# EAGLE design master (EAGLE 7.4.0)

## Sheet 1 of 2
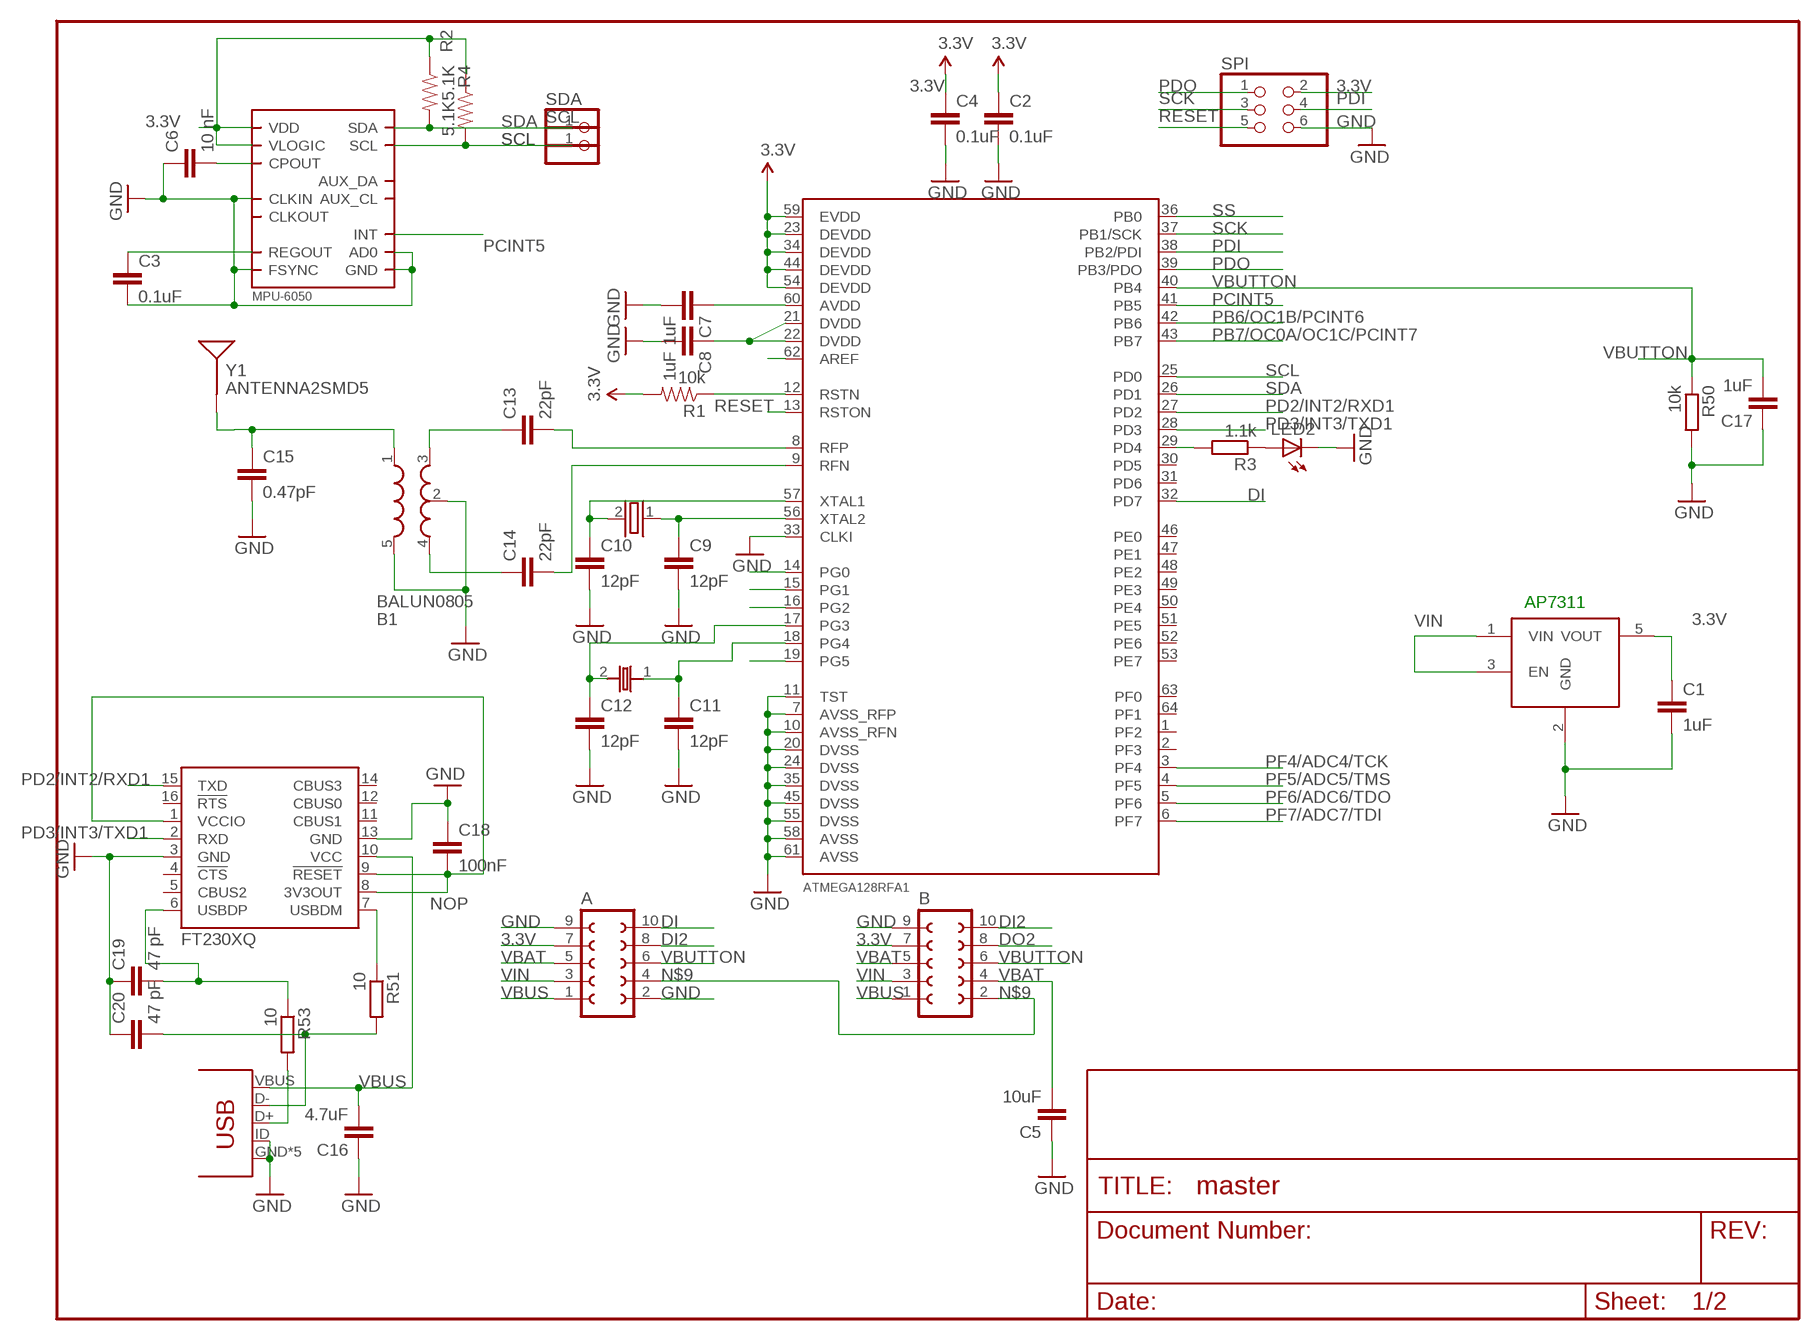
[diagram p0: schematic, sheet 1]

### Parts
A  FE05-2W  [FE05-2W]
B  FE05-2W  [FE05-2W]
B1  BALUN0805  [BALUN]
C1  1uF  C-EUC0603  [C0603]
C2  0.1uF  CAP0603-CAP  [0603-CAP]
C3  0.1uF  CAP0603-CAP  [0603-CAP]
C4  0.1uF  CAP0603-CAP  [0603-CAP]
C5  10uF  CAP0603-CAP  [0603-CAP]
C6  10 nF  CAP0603-CAP  [0603-CAP]
C7  1uF  CAP0805  [0805]
C8  1uF  CAP0805  [0805]
C9  12pF  CAP0603-CAP  [0603-CAP]
C10  12pF  CAP0603-CAP  [0603-CAP]
C11  12pF  CAP0603-CAP  [0603-CAP]
C12  12pF  CAP0603-CAP  [0603-CAP]
C13  22pF  CAP0603-CAP  [0603-CAP]
C14  22pF  CAP0603-CAP  [0603-CAP]
C15  0.47pF  CAP0603-CAP  [0603-CAP]
C16  4.7uF  CAP0603-CAP  [0603-CAP]
C17  1uF  CAP0805  [0805]
C18  100nF  CAP0603-CAP  [0603-CAP]
C19  47 pF  CAP0603-CAP  [0603-CAP]
C20  47 pF  CAP0603-CAP  [0603-CAP]
IC1  FT230XQ  [QFN16]
LED2  LEDCHIPLED_0603  [CHIPLED_0603]
MICRO-USB  USB-CONNECTOR  [MICRO-USB-435-645]
QUARTZ1  753-7203  [753-7203]
QUARTZ2  QUARTZ32768  [QUARTZ32768]
R1  10k  RESISTOR0603-RES  [0603-RES]
R2  5.1K  RESISTOR0603-RES  [0603-RES]
R3  1.1k  R-EU_R0603  [R0603]
R4  5.1K  RESISTOR0603-RES  [0603-RES]
R50  10k  R-EU_R0603  [R0603]
R51  10  R-EU_R0603  [R0603]
R53  10  R-EU_R0603  [R0603]
SCL  PINHD-1X1  [1X01]
SDA  PINHD-1X1  [1X01]
SPI  PINHD-2X3  [2X03]
U1  ATMEGA128RFA1  [QFN-64]
U$1  MPU-6050  [QFN.24.4X4]
U$7  MIC5366-2.8YMT  [SOT23-5]
Y1  ANTENNA2SMD5  [ANTENNA-CHIP5]

### Nets
3.3V: A.7 B.7 C1.1 C2.1 C4.1 R1.2 R2.1 R4.1 SPI.2 U1.23(DEVDD) U1.34(DEVDD) U1.44(DEVDD) U1.54(DEVDD) U1.59(EVDD) U$1.8(VLOGIC) U$1.13(VDD) U$7.5(VOUT)
AREF: U1.62(AREF)
DI: A.10 U1.32(PD7)
DI2: A.8 B.10
DO2: B.8
GND: A.2 A.9 B1.2(GND) B1.5(GND) B.9 C1.2 C2.2 C3.2 C4.2 C5.1 C6.1 C7.2 C8.2 C9.2 C10.2 C11.2 C12.2 C15.2 C16.1 C17.1 C18.1 C19.1 C20.1 IC1.3(GND) IC1.13(GND) LED2.C MICRO-USB.GND MICRO-USB.GND1(GND) MICRO-USB.GND2(GND) MICRO-USB.GND3(GND) MICRO-USB.GND4(GND) MICRO-USB.ID R50.2 SPI.6 U1.7(AVSS_RFP) U1.10(AVSS_RFN) U1.11(TST) U1.20(DVSS) U1.24(DVSS) U1.33(CLKI) U1.35(DVSS) U1.45(DVSS) U1.55(DVSS) U1.58(AVSS) U1.61(AVSS) U$1.1(CLKIN) U$1.9(AD0) U$1.11(FSYNC) U$1.18(GND) U$7.2(GND)
N$1: B1.3(OUT1) C13.1
N$2: B1.4(OUT2) C14.1
N$3: LED2.A R3.1
N$4: B1.1(IN) C15.1 Y1.FEED(SIGNAL)
N$5: C8.1 U1.21(DVDD) U1.22(DVDD)
N$6: C14.2 U1.9(RFN)
N$7: C13.2 U1.8(RFP)
N$8: R3.2 U1.29(PD4)
N$9: A.4 B.2
N$10: C7.1 U1.60(AVDD)
N$11: C3.1 U$1.10(REGOUT)
N$12: C10.1 QUARTZ1.2 U1.57(XTAL1)
N$13: C9.1 QUARTZ1.1 U1.56(XTAL2)
N$14: C12.1 QUARTZ2.2 U1.17(PG3)
N$15: C11.1 QUARTZ2.1 U1.18(PG4)
N$16: C6.2 U$1.20(CPOUT)
N$64: IC1.7(USBDM) R51.1
N$65: C20.2 MICRO-USB.D- R51.2
N$109: C19.2 IC1.6(USBDP) R53.1
N$110: MICRO-USB.D+ R53.2
NOP: C18.2 IC1.1(VCCIO) IC1.8(3V3OUT) IC1.9(!RESET)
PB6/OC1B/PCINT6: U1.42(PB6)
PB7/OC0A/OC1C/PCINT7: U1.43(PB7)
PCINT5: U1.41(PB5) U$1.12(INT)
PD2/INT2/RXD1: IC1.15(TXD) U1.27(PD2)
PD3/INT3/TXD1: IC1.2(RXD) U1.28(PD3)
PDI: SPI.4 U1.38(PB2/PDI)
PDO: SPI.1 U1.39(PB3/PDO)
PF4/ADC4/TCK: U1.3(PF4)
PF5/ADC5/TMS: U1.4(PF5)
PF6/ADC6/TDO: U1.5(PF6)
PF7/ADC7/TDI: U1.6(PF7)
PG0: U1.14(PG0)
PG1: U1.15(PG1)
PG2: U1.16(PG2)
PG5: U1.19(PG5)
RESET: R1.1 SPI.5 U1.12(RSTN)
RSTON: U1.13(RSTON)
SCK: SPI.3 U1.37(PB1/SCK)
SCL: R4.2 SCL.1 U1.25(PD0) U$1.23(SCL)
SDA: R2.2 SDA.1 U1.26(PD1) U$1.24(SDA)
SS: U1.36(PB0)
VBAT: A.5 B.4 B.5 C5.2
VBUS: A.1 B.1 C16.2 IC1.10(VCC) MICRO-USB.VBUS
VBUTTON: A.6 B.6 C17.2 R50.1 U1.40(PB4)
VIN: A.3 B.3 U$7.1(VIN) U$7.3(EN)
Unconnected: IC1.4(!CTS) IC1.5(CBUS2) IC1.11(CBUS1) IC1.12(CBUS0) IC1.14(CBUS3) IC1.16(!RTS) U1.1(PF2) U1.2(PF3) U1.30(PD5) U1.31(PD6) U1.46(PE0) U1.47(PE1) U1.48(PE2) U1.49(PE3) U1.50(PE4) U1.51(PE5) U1.52(PE6) U1.53(PE7) U1.63(PF0) U1.64(PF1) U$1.6(AUX_DA) U$1.7(AUX_CL) U$1.22(CLKOUT)

### Notes on the sheet
- AP7311

## Sheet 2 of 2

## Library data of the parts
A B = con-lsta:FE05-2W: FEMALE HEADER; OC_FARNELL: unknown; OC_NEWARK: unknown
B1 = SparkFun:BALUN
C1 = rcl:C-EU: CAPACITOR, European symbol
C2-C20 = SparkFun:CAP: Capacitor Standard 0603 ceramic capacitor, and 0.1" leaded capacitor.
IC1 = ftdichip:FT230X: USB to BASIC UART IC Auto generated by make-symbol-device-package-bsdl.ulp Rev. 43 Source: Data sheet <http://www.ftdichip.com/Support/Documents/DataSheets/ICs/DS_FT230X.pdf>
LED2 = led:LED: LED OSRAM: - CHIPLED LG R971, LG N971, LY N971, LG Q971, LY Q971, LO R971, LY R971 LH N974, LH R974 LS Q976, LO Q976, LY Q976 LO Q996 - Hyper CHIPLED LW Q18S LB Q993, LB Q99A, LB R99A - SideLED LS A670, LO A670, LY A670, LG A670, LP A670 LB A673, LV A673, LT A673, LW A673 LH A674 LY A675 LS A676, LA A676, LO A676, LY A676, LW A676 LS A679, LY A679, LG A679 - Hyper Micro SIDELED® LS Y876, LA Y876, LO Y876, LY Y876 LT Y87S - SmartLED LW L88C, LW L88S LB L89C, LB L89S, LG L890 LS L89K, LO L89K, LY L89K LS L896, LA L896, LO L896, LY L896 - TOPLED LS T670, LO T670, LY T670, LG T670, LP T670 LSG T670, LSP T670, LSY T670, LOP T670, LYG T670 LG T671, LOG T671, LSG T671 LB T673, LV T673, LT T673, LW T673 LH T674 LS T676, LA T676, LO T676, LY T676, LB T676, LH T676, LSB T676, LW T676 LB T67C, LV T67C, LT T67C, LS T67K, LO T67K, LY T67K, LW E67C LS E67B, LA E67B, LO E67B, LY E67B, LB E67C, LV E67C, LT E67C LW T67C LS T679, LY T679, LG T679 LS T770, LO T770, LY T770, LG T770, LP T770 LB T773, LV T773, LT T773, LW T773 LH T774 LS E675, LA E675, LY E675, LS T675 LS T776, LA T776, LO T776, LY T776, LB T776 LHGB T686 LT T68C, LB T68C - Hyper Mini TOPLED® LB M676 - Mini TOPLED Santana® LG M470 LS M47K, LO M47K, LY M47K Source: http://www.osram.convergy.de LUXEON: - LUMILED® LXK2-PW12-R00, LXK2-PW12-S00, LXK2-PW14-U00, LXK2-PW14-V00 LXK2-PM12-R00, LXK2-PM12-S00, LXK2-PM14-U00 LXK2-PE12-Q00, LXK2-PE12-R00, LXK2-PE12-S00, LXK2-PE14-T00, LXK2-PE14-U00 LXK2-PB12-K00, LXK2-PB12-L00, LXK2-PB12-M00, LXK2-PB14-N00, LXK2-PB14-P00, LXK2-PB14-Q00 LXK2-PR12-L00, LXK2-PR12-M00, LXK2-PR14-Q00, LXK2-PR14-R00 LXK2-PD12-Q00, LXK2-PD12-R00, LXK2-PD12-S00 LXK2-PH12-R00, LXK2-PH12-S00 LXK2-PL12-P00, LXK2-PL12-Q00, LXK2-PL12-R00 Source: www.luxeon.com KINGBRIGHT: KA-3528ASYC Source: www.kingbright.com
MICRO-USB = myrobotics2:USB-CONNECTOR
QUARTZ1 = myrobotics2:753-7203
QUARTZ2 = myrobotics2:QUARTZ32768
R1 R2 R4 = SparkFun:RESISTOR: Resistor Basic schematic elements and footprints for 0603, 1206, and PTH resistors.
R3 R50 R51 R53 = rcl:R-EU_: RESISTOR, European symbol
SCL SDA = pinhead:PINHD-1X1: PIN HEADER
SPI = pinhead:PINHD-2X3: PIN HEADER
U1 = SparkFun:ATMEGA128RFA1
U$1 = MPU6050:MPU-6050
U$7 = SparkFun:MIC5366-2.8YMT
Y1 = SparkFun:ANTENNA2: Antenna Single endded antenna. Common with smaller chip antennas. CHIP4 package is the GPS Chip Antenna SKU: GPS-08418. CHIP5 package is 2.4GHz chip antenna SKU: WRL-00144.

## Net classes
0 default: width 0.152 mm, drill 0.178 mm, clearance 0.178 mm
1 GND: width 0.203 mm, drill 0.203 mm, clearance 0.203 mm

## Board
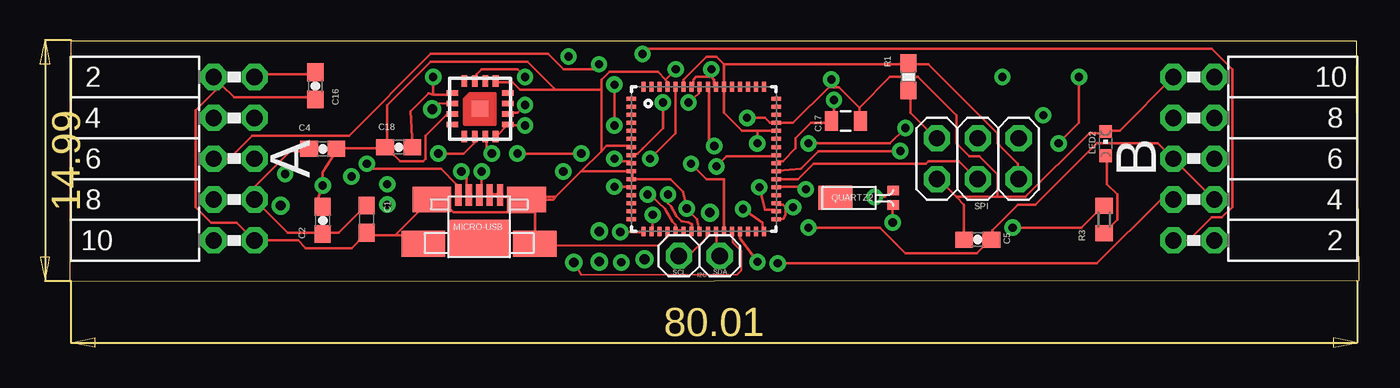
[diagram p1: board, top side]
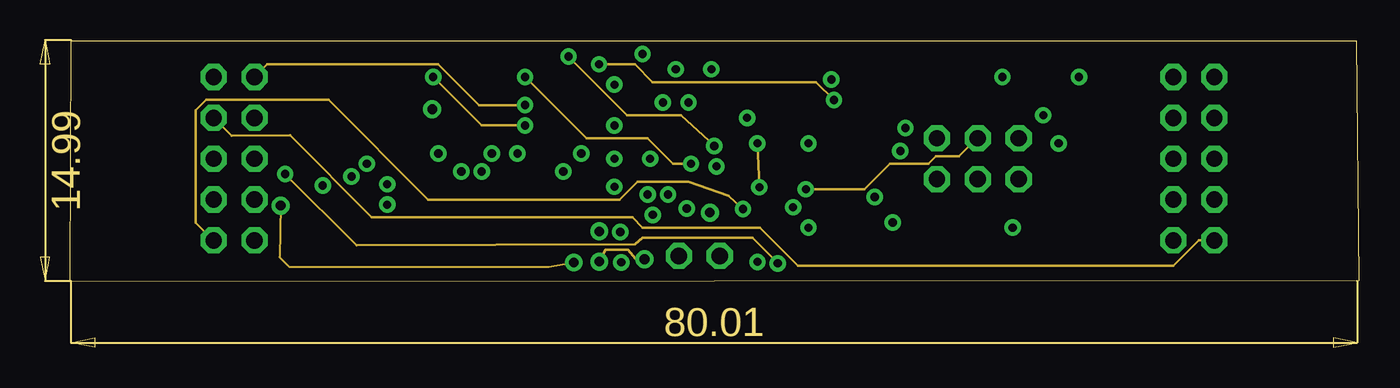
[diagram p2: board, inner layer Route2]
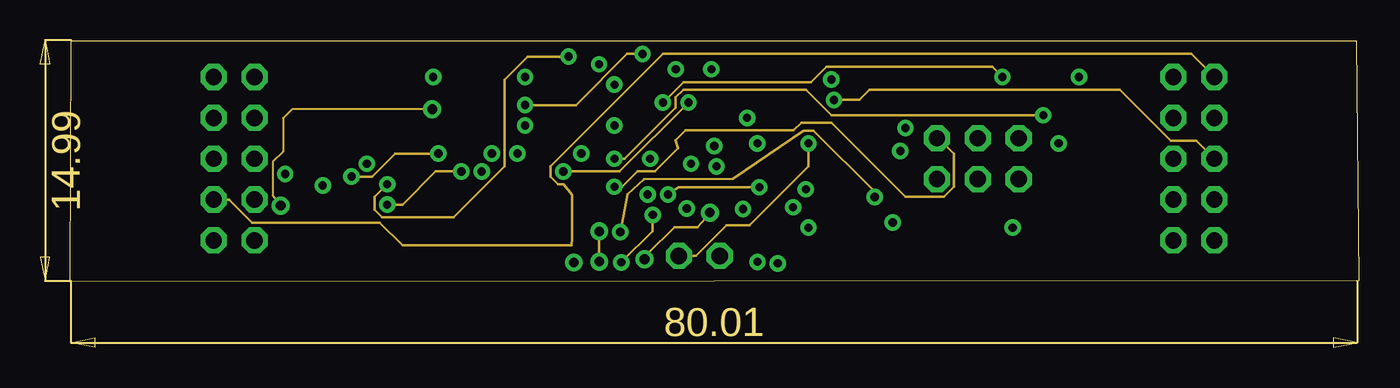
[diagram p3: board, inner layer Route3]
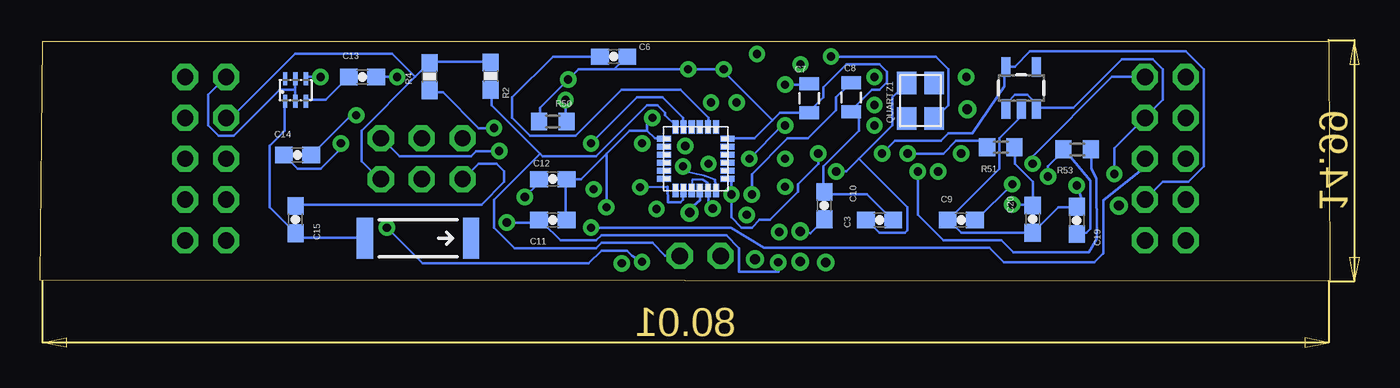
[diagram p4: board, bottom side, seen from below]

Size 80.22 x 14.91 mm. Coordinates in mm from the lower left corner, seen from the top.
Outline: 0,0 80.22,0.08 80.07,14.91 0.08,14.91 0,0
Copper layers (1*2*3*16): Top 0.035mm / dielectric 0.25mm / Route2 0.035mm / dielectric 0.25mm / Route3 0.035mm / dielectric 0.25mm / Bottom 0.035mm
Design rules "SparkFun": minimum track width 6mil, minimum drill 20mil, track to track 4mil, track to pad 4mil, pad to pad 4mil, via to via 4mil, smd to smd 4mil, copper to edge 8mil, drill to drill 8mil, minimum pad ring 12mil, minimum via ring 10mil, stop-mask expansion 4mil, vias tented up to drill 20mil, thermal gap 10mil

### Footprints (pad centres in the part's own frame; a part is rotated, then mirrored left to right if it is on the bottom)
FE05-2W = drill 1.016 octagon: 1 -5.08,1.27; 2 -5.08,-1.27; 3 -2.54,1.27; 4 -2.54,-1.27; 5 0,1.27; 6 0,-1.27; 7 2.54,1.27; 8 2.54,-1.27; 9 5.08,1.27; 10 5.08,-1.27
BALUN = smd 0.27 x 0.8: 1 -0.7,-0.7; 2 -0.05,-0.7; 3 0.6,-0.7; 4 0.6,0.7; 5 -0.05,0.7; 6 -0.7,0.7
C0603 = smd 1.1 x 1: 1 -0.85,0; 2 0.85,0
0603-CAP = smd 1.1 x 1: 1 -0.85,0; 2 0.85,0
0805 = smd 0.8 x 1.2: 1 -0.9,0; 2 0.9,0
QFN16 = smd 0.7 x 0.35: 1 -1.725,0.975; 2 -1.725,0.325; 3 -1.725,-0.325; 4 -1.725,-0.975; 9 1.725,-0.975; 10 1.725,-0.325; 11 1.725,0.325; 12 1.725,0.975 | smd 0.35 x 0.7: 5 -0.975,-1.725; 6 -0.325,-1.725; 7 0.325,-1.725; 8 0.975,-1.725; 13 0.975,1.725; 14 0.325,1.725; 15 -0.325,1.725; 16 -0.975,1.725 | smd 1 x 1: TAB 0,0
CHIPLED_0603 = smd 0.8 x 0.8: A 0,-0.75; C 0,0.75
MICRO-USB-435-645 = smd 0.4 x 1.35: D+ 0,0.275; D- -0.65,0.275; GND 1.3,0.275; ID 0.65,0.275; VBUS -1.3,0.275 | smd 2.4 x 1.6: GND1 -2.95,0; GND2 2.95,0 | smd 2.7 x 1.6: GND3 -3.475,-2.75; GND4 3.475,-2.75 | smd 3.75 x 2.3: P$7 0,-2.4
753-7203 = smd 1.4 x 1.2: 1 -1.1,-0.8; 2 1.1,0.9; P$1 -1.1,0.9; P$4 1.1,-0.8
QUARTZ32768 = smd 0.7 x 0.6: 1 0,-0.45; 2 0,0.45 | smd 2.1 x 1.5: 3 -3.6,0
0603-RES = smd 1.1 x 1: 1 -0.85,0; 2 0.85,0
R0603 = smd 1 x 1.1: 1 -0.85,0; 2 0.85,0
1X01 = drill 1.016 octagon: 1 0,0
2X03 = drill 1.016 octagon: 1 -2.54,-1.27; 2 -2.54,1.27; 3 0,-1.27; 4 0,1.27; 5 2.54,-1.27; 6 2.54,1.27
QFN-64 = smd 0.6 x 0.25: 1 -4.5,3.75; 2 -4.5,3.25; 3 -4.5,2.75; 4 -4.5,2.25; 5 -4.5,1.75; 6 -4.5,1.25; 7 -4.5,0.75; 8 -4.5,0.25; 9 -4.5,-0.25; 10 -4.5,-0.75; 11 -4.5,-1.25; 12 -4.5,-1.75; 13 -4.5,-2.25; 14 -4.5,-2.75; 15 -4.5,-3.25; 16 -4.5,-3.75; 33 4.5,-3.75; 34 4.5,-3.25; 35 4.5,-2.75; 36 4.5,-2.25; 37 4.5,-1.75; 38 4.5,-1.25; 39 4.5,-0.75; 40 4.5,-0.25; 41 4.5,0.25; 42 4.5,0.75; 43 4.5,1.25; 44 4.5,1.75; 45 4.5,2.25; 46 4.5,2.75; 47 4.5,3.25; 48 4.5,3.75 | smd 0.25 x 0.6: 17 -3.75,-4.5; 18 -3.25,-4.5; 19 -2.75,-4.5; 20 -2.25,-4.5; 21 -1.75,-4.5; 22 -1.25,-4.5; 23 -0.75,-4.5; 24 -0.25,-4.5; 25 0.25,-4.5; 26 0.75,-4.5; 27 1.25,-4.5; 28 1.75,-4.5; 29 2.25,-4.5; 30 2.75,-4.5; 31 3.25,-4.5; 32 3.75,-4.5; 49 3.75,4.5; 50 3.25,4.5; 51 2.75,4.5; 52 2.25,4.5; 53 1.75,4.5; 54 1.25,4.5; 55 0.75,4.5; 56 0.25,4.5; 57 -0.25,4.5; 58 -0.75,4.5; 59 -1.25,4.5; 60 -1.75,4.5; 61 -2.25,4.5; 62 -2.75,4.5; 63 -3.25,4.5; 64 -3.75,4.5
QFN.24.4X4 = smd 0.85 x 0.38: 1 -1.975,1.25; 2 -1.975,0.75; 3 -1.975,0.25; 4 -1.975,-0.25; 5 -1.975,-0.75; 6 -1.975,-1.25; 13 1.975,-1.25; 14 1.975,-0.75; 15 1.975,-0.25; 16 1.975,0.25; 17 1.975,0.75; 18 1.975,1.25 | smd 0.38 x 0.85: 7 -1.25,-1.975; 8 -0.75,-1.975; 9 -0.25,-1.975; 10 0.25,-1.975; 11 0.75,-1.975; 12 1.25,-1.975; 19 1.25,1.975; 20 0.75,1.975; 21 0.25,1.975; 22 -0.25,1.975; 23 -0.75,1.975; 24 -1.25,1.975
SOT23-5 = smd 0.55 x 1.2: 1 -0.95,-1.3; 2 0,-1.3; 3 0.95,-1.3; 4 0.95,1.3; 5 -0.95,1.3
ANTENNA-CHIP5 = smd 1.016 x 2.54: FEED -3.302,0; NC 3.302,0

### Placement (x,y rotation side)
A  10.24,7.62 270 top
B  69.93,7.62 90 top
B1  64.29,11.89 0 bottom
C1  18.47,3.86 270 top
C2  15.75,3.78 90 top
C3  31.45,4.7 90 bottom
C4  15.75,8.23 0 top
C5  56.49,2.59 0 top
C6  44.55,13.97 180 bottom
C7  32.38,11.38 270 bottom
C8  29.77,11.43 270 bottom
C9  22.94,3.81 180 bottom
C10  28.02,3.81 0 bottom
C11  48.34,3.81 0 bottom
C12  48.34,6.35 0 bottom
C13  60.17,12.7 0 bottom
C14  64.21,7.85 0 bottom
C15  64.34,3.84 90 bottom
C16  15.29,12.14 90 top
C17  48.29,9.96 180 top
C18  20.47,8.33 0 top
C19  15.75,3.78 270 bottom
C20  18.49,3.86 90 bottom
IC1  25.53,10.72 0 top
LED2  64.44,8.56 0 top
MICRO-USB  25.48,5.08 0 top
QUARTZ1  25.43,11.23 90 bottom
QUARTZ2  51.23,5.18 0 top
R1  52.17,12.7 90 top
R2  52.2,12.75 270 bottom
R3  64.34,3.84 90 top
R4  56.01,12.73 270 bottom
R50  48.34,9.93 180 bottom
R51  20.47,8.33 0 bottom
R53  15.72,8.2 0 bottom
SCL  37.9,1.57 0 top
SDA  40.44,1.57 0 top
SPI  56.49,7.62 180 top
U1  39.45,7.59 0 top
U$1  39.45,7.62 0 bottom
U$7  19.2,12.01 0 bottom
Y1  56.72,2.67 0 bottom

### Tracks (layer width: path | path; a pad name or v marks a point on that pad's centre or on a via)
3.3V  (via drill 0.51)
  Top 0.152: C1.1 18.33,4.6 16.75,3.02 15.32,3.02 C2.1 15.16,3.02 13.57,3.02 A.7 11.51,5.87 13.73,8.1 14.84,8.1 C4.1 | 38.65,3.17 U1.23 38.68,3.13 38.71,3.56 38.45,3.68 38.05,3.73 37.74,4.04 37.41,4.65 37.22,4.84 v37.22,5.4 | v42.91,5.85 43.27,4.44 43.89,4.44 U1.34 | 40.72,13.49 40.24,13.97 39.61,13.97 38.18,12.54 38.18,12.22 U1.59 | 40.72,13.49 40.72,12.22 U1.54 40.72,12.06 40.72,10.48 41.83,9.37 42.78,9.37 | 42.78,9.37 43.89,9.37 U1.44 | 40.72,13.49 52.15,13.49 R1.2 52.3,13.49 53.42,13.49 57.7,9.21 57.7,8.57 58.97,7.3 58.97,6.35 SPI.2 | 42.78,9.37 v42.78,8.57 | v31.83,7.94 v27.86,7.94
  Route2 0.152: v42.78,8.57 v42.91,5.85
  Route3 0.152: v37.22,5.4 37.87,5.85 v42.91,5.85
  Bottom 0.152: R2.1 52.3,13.65 55.96,13.65 R4.1 56.12,13.49 56.91,12.7 | 56.91,12.7 60.24,9.37 60.24,7.46 59.13,6.35 SPI.2 | B.7 68.34,10.16 64.37,14.13 58.34,14.13 56.91,12.7 | A.7 10.4,6.19 8.81,6.19 7.85,7.14 7.85,13.18 8.97,14.29 18.65,14.29 19.6,13.34 20.08,13.34 U$7.5 20.24,13.18 20.24,12.13 22.25,9.21 23.73,9.21 24.21,8.73 27.06,8.73 v27.86,7.94 | U$1.13 37.38,6.35 37.22,6.19 v37.22,5.4 37.22,3.97 36.59,3.33 35.95,3.33 35.48,3.81 34.84,3.81 33.1,5.56 33.1,6.03 31.83,7.3 v31.83,7.94 | v42.91,5.85 41.2,5.87 41.19,4.92 40.4,4.92 40.24,5.08 40.24,5.56 U$1.8
DI  (via drill 0.51)
  Top 0.152: v41.88,4.49 41.9,4.49 43.1,3.65 43.1,3.17 U1.32
  Route2 0.152: v41.88,4.49 40.98,5.3 38.49,6.19 35.32,6.19 34.21,5.08 22.3,5.08 16.11,11.27 8.49,11.27 7.85,10.64 7.85,3.65 A.10
DI2
  Route3 0.152: A.8 9.92,5.08 11.35,3.65 19.29,3.65 20.71,2.22 31.23,2.22 31.25,2.67 31.25,5.39 30.71,6.03 30.4,6.03 29.92,6.51 29.92,7.14 36.91,14.13 69.77,14.13 B.10
GND  (via drill 0.51)
  Top 0.152: 9.44,12.22 10.24,11.43 15.16,11.43 C16.1 | 20.24,2.86 21.51,2.86 21.98,2.38 MICRO-USB.GND3 | 20.24,2.86 18.49,2.86 C1.2 18.33,2.86 17.54,2.06 14.68,2.06 14.21,2.54 A.9 10.4,3.65 8.81,3.65 7.85,4.6 7.85,10.64 9.44,12.22 | 20.24,2.86 22.46,5.08 MICRO-USB.GND1 23.09,5.08 23.89,4.29 28.97,4.29 | 9.44,12.22 A.2 | C19.1 15.32,4.76 v15.75,5.95 15.75,6.77 16.59,8.1 C4.2 16.75,8.25 19.6,8.25 C18.1 | IC1.3 23.73,10.32 23.41,10.32 22.14,9.05 22.14,7.62 21.98,7.46 20.55,7.46 19.76,8.25 C18.1 | U1.20 37.22,3.02 37.25,2.83 36.61,2.2 28.97,2.22 MICRO-USB.GND4 28.97,2.38 28.97,4.29 | 35,6.35 35,6.83 U1.10 34.84,6.83 31.83,6.83 | 35,6.35 37.38,6.35 38.16,5.57 v38.39,4.52 39.03,3.86 U1.24 | 35,6.35 U1.11 | MICRO-USB.ID 26.27,5.4 26.75,5.4 MICRO-USB.GND 26.91,5.24 30.24,5.24 | 30.24,5.24 30.08,5.08 28.97,5.08 | 30.24,5.24 31.83,6.83 | 31.83,6.83 33.1,8.1 | 33.1,8.1 33.41,8.41 34.84,8.41 U1.7 | MICRO-USB.GND2 28.97,5.08 | 37.06,12.54 36.59,13.02 33.57,13.02 33.1,12.54 33.1,11.91 | 37.06,12.54 37.22,12.38 37.22,12.22 U1.61 | 33.1,8.1 33.1,11.91 | 33.1,11.91 30.24,11.91 | 30.24,11.91 28.02,11.91 27.54,12.38 26.59,12.38 IC1.13 | 28.97,5.08 28.97,4.29 | 28.49,5.08 MICRO-USB.GND2 | 30.24,11.91 28.49,13.65 22.46,13.65 19.76,10.95 19.76,8.41 C18.1 | 28.97,4.29 MICRO-USB.GND2 | B.9 65.32,9.37 64.53,9.37 LED2.C 64.37,9.21 63.42,9.21 59.45,5.24 57.7,5.24 | 55.16,5.24 54.05,6.35 SPI.6 | 55.16,5.24 55.64,4.76 55.64,2.7 C5.1 | 55.16,5.24 57.7,5.24 | 44.53,4.6 44.53,4.13 44.42,3.89 44.1,3.84 U1.33 | 44.53,4.6 44.37,4.76 44.05,4.76 U1.35 | v45,4.6 44.53,4.6 | 47.38,12.06 47.86,12.06 49.13,10.8 | 47.38,12.06 47.23,12.06 45,9.84 44.05,9.84 U1.45 43.89,9.84 43.57,9.84 43.26,10.16 v42.15,10.16
  Top 0.152: 49.13,10.8 49.13,10 C17.1 | 39.92,12.7 38.97,12.7 38.81,12.54 38.81,12.22 U1.58 | 39.92,12.7 40.08,12.54 40.08,12.22 U1.55 | v39.92,13.18 39.92,12.7 | v47.38,12.54 47.38,12.06 | 57.7,5.24 57.7,6.67 56.59,7.78 55.96,7.78 55.16,8.57 55.16,10.32 52.78,12.7 51.04,12.7 49.13,10.8 | v37.7,13.18 37.06,12.54
  Bottom 0.127: U$1.11 38.72,6.13 | 38.99,6.3 39.67,6.3 39.67,5.67
  Bottom 0.152: C20.1 16.9,4.6 15.32,4.6 C19.1 15.32,4.76 v15.75,5.95 | 23.73,3.81 22.94,3.02 C20.1 | C20.1 | 23.73,3.81 20.55,6.98 20.55,8.89 19.29,10.16 19.29,10.64 U$7.2 | 23.73,3.81 C9.2 | v38.39,4.52 38.65,4.92 38.65,5.56 U$1.11 | 64.37,11.91 64.37,12.54 B1.5 | 64.37,11.91 64.37,11.27 B1.2 | 64.37,11.91 65.32,11.91 68.18,9.05 69.13,9.05 69.77,9.68 69.77,11.59 B.9 | C15.2 64.21,4.76 52.78,4.76 51.35,6.19 51.35,6.83 51.83,7.3 52.94,7.3 53.89,6.35 SPI.6 | C10.2 27.22,3.81 28.81,5.4 31.35,5.4 C3.2 31.51,5.56 31.51,7.14 29.31,9.37 29.31,10.53 C8.2 29.76,10.64 28.49,11.91 28.02,11.91 27.54,12.38 27.54,13.02 28.02,13.49 30.08,13.49 31.51,12.06 31.51,11.43 32.3,10.64 C7.2 32.46,10.48 34.21,10.48 34.68,10 | 42.46,9.37 41.99,8.89 41.51,8.89 U$1.1 | 42.46,9.37 43.57,9.37 45,7.94 | 45,7.94 46.59,6.35 C12.2 47.54,6.35 47.54,3.81 C11.2 | 45,7.94 v45,4.6 | 34.68,10 35.8,8.89 37.38,8.89 U$1.18 | 44.53,13.18 46.75,13.18 v47.38,12.54 49.13,10.8 49.13,10 R50.2 | 44.53,13.18 43.73,13.97 C6.1 | 44.53,13.18 v39.92,13.18 37.86,13.18 | 37.86,13.18 34.68,10 | 42.46,9.37 42.46,9.84 v42.15,10.16 | 37.86,13.18 v37.7,13.18 | 38.72,6.13 38.99,6.3 | 39.67,5.67 U$1.9
N$1
  Bottom 0.152: B1.3 63.58,11.27 62.47,11.27 C13.1
N$2  (via drill 0.51)
  Top 0.152: v62.78,12.7 62.78,9.84 v61.51,8.57
  Bottom 0.152: v62.78,12.7 63.58,12.7 B1.4 | v61.51,8.57 61.51,8.25 62.78,6.98 64.21,6.98 65,7.78 C14.1
N$3
  Top 0.152: LED2.A 64.53,7.78 64.53,6.03 65.16,5.4 65.16,3.81 64.37,3.02 R3.1
N$4
  Bottom 0.152: B1.1 65,11.11 65,9.37 65.96,8.41 65.96,4.6 64.37,3.02 C15.1 64.21,2.86 64.05,2.7 60.08,2.7 Y1.FEED
N$5  (via drill 0.51)
  Top 0.152: U1.22 38.18,3.17 37.7,3.17 U1.21 37.69,3.12 37.69,3.5 37.49,3.71 37.11,4.37 37.03,4.5 36.14,5.36 36.14,5.4 v35.95,5.4
  Bottom 0.152: v35.95,5.4 35.95,6.67 33.73,8.89 32.46,8.89 30.71,10.64 30.71,11.43 29.92,12.22 C8.1
N$6  (via drill 0.51)
  Top 0.152: v33.89,7.62 34.05,7.46 34.84,7.46 U1.9
  Route3 0.152: v33.89,7.62 34.52,7.62 37.7,10.8 37.7,11.43 38.18,11.91 45.8,11.91 47.38,10.32 v60.56,10.32
  Bottom 0.152: v60.56,10.32 60.88,10.32 63.26,7.94 C14.2
N$7  (via drill 0.51)
  Top 0.152: v36.91,11.11 36.91,9.52 35.62,8.24 35.33,7.94 U1.8
  Route3 0.152: v36.91,11.11 38.18,12.38 46.11,12.38 47.07,13.34 57.38,13.34 v58.02,12.7
  Bottom 0.152: C13.2 v58.02,12.7
N$8  (via drill 0.51)
  Top 0.152: v42.79,1.21 41.69,2.69 41.67,3.02 U1.29 | v58.66,3.33 62.94,3.33 64.21,4.6 R3.2
  Bottom 0.152: v42.79,1.21 43.41,1.59 43.73,1.9 45.32,1.9 46.11,1.11 56.43,1.11 v58.66,3.33
N$9
  Route2 0.152: B.2 70.24,2.54 68.66,0.95 45.32,0.95 42.94,3.33 35.64,3.33 35,3.97 18.79,3.99 13.71,9.07 10.08,9.05 A.4
N$10  (via drill 0.51)
  Top 0.152: v36.11,7.62 37.7,9.21 37.7,12.06 U1.60 | v33.89,12.22 v33.89,9.68
  Bottom 0.152: v36.11,7.62 34.05,9.68 v33.89,9.68 | v33.89,12.22 32.46,12.22 C7.1
N$11  (via drill 0.6)
  Route2 0.152: v35.76,1.37 35.2,1.4 34.72,1.96 33.35,1.96 v32.94,1.22
  Route3 0.152: v39.83,4.27 39.83,4.22 39.06,3.35 37.62,3.35 35.99,1.73 35.99,1.37 v35.76,1.37 | v32.94,1.22 v32.94,3.1
  Bottom 0.152: U$1.10 39.2,5.02 39.8,4.5 v39.83,4.27 | v32.94,3.1 32.3,3 C3.1
N$12  (via drill 0.51)
  Top 0.152: v38.49,11.11 39.15,11.7 39.13,12.06 U1.57
  Route3 0.152: v38.49,11.11 34.21,6.83 v30.71,6.83
  Bottom 0.152: v30.71,6.83 30.08,6.83 29.29,7.62 | 29.29,7.62 27.22,9.68 27.22,11.43 26.43,12.22 QUARTZ1.2 | 29.29,7.62 26.27,4.6 26.27,3.17 26.43,3.02 28.02,3.02 28.81,3.81 C10.1
N$13  (via drill 0.51)
  Top 0.152: v40.1,8.41 39.76,8.57 39.76,12.06 U1.56
  Route2 0.152: v40.1,8.41 38.02,10.32 34.68,10.32 v31.03,13.97
  Route3 0.152: v19.76,6.03 18.97,5.24 18.97,4.44 19.44,3.97 23.89,3.97 27.06,7.14 27.06,12.54 28.49,13.97 v31.03,13.97
  Bottom 0.152: v31.03,13.97 24.52,13.97 23.73,13.18 23.73,10.95 24.52,10.16 QUARTZ1.1 | v19.76,6.03 21.98,3.81 C9.1
N$14  (via drill 0.51)
  Top 0.152: v34.26,3.07 35.64,3.02 U1.17 | v50.08,5.24 50.72,5.24 51.19,5.71 QUARTZ2.2
  Route3 0.152: v34.26,3.07 34.69,5.4 35.72,6.35 41.27,6.38 45.64,9.37 46.27,9.37 50.08,5.56 v50.08,5.24
  Bottom 0.152: v50.08,5.24 49.29,6.03 49.29,6.35 C12.1
N$15  (via drill 0.51)
  Top 0.152: v36.27,4.13 36.27,3.17 U1.18 | v51.19,3.65 51.19,4.6 QUARTZ2.1
  Route3 0.152: v36.27,4.13 36.27,3.1 v34.31,1.17
  Bottom 0.152: 48.97,3.65 49.13,3.81 C11.1 48.97,3.65 | 48.97,3.65 47.86,2.54 45.64,2.54 45.32,2.86 37.54,2.86 36.75,2.06 36.75,0.83 36.75,0.58 34.3,0.58 v34.31,1.17 | 48.97,3.65 v51.19,3.65
N$16
  Bottom 0.152: C6.2 48.34,13.97 50.88,11.43 50.88,10.16 49.77,9.05 46.91,9.05 44.05,11.91 40.4,11.91 38.65,10.16 38.65,9.68 U$1.20
N$64  (via drill 0.51)
  Top 0.152: v26.27,7.94 25.95,8.25 25.95,8.89 IC1.7
  Bottom 0.152: v26.27,7.94 24.05,7.94 23.25,8.73 21.67,8.73 21.35,8.41 R51.1
N$65  (via drill 0.51)
  Top 0.152: v24.37,6.83 24.68,6.51 24.68,5.4 MICRO-USB.D-
  Route3 0.152: v24.37,6.83 22.78,6.83 20.71,4.76 v19.76,4.76
  Bottom 0.152: 18.49,4.76 18.49,6.19 19.6,7.3 19.6,8.25 R51.2 | 18.49,4.76 v19.76,4.76 | 18.49,4.76 C20.2
N$109  (via drill 0.51)
  Top 0.152: v22.94,7.94 24.52,7.94 25.16,8.57 25.16,8.89 IC1.6
  Route3 0.152: v22.94,7.94 20.24,7.94 18.81,6.51 v17.54,6.51
  Bottom 0.152: v17.54,6.51 17.54,7.14 16.59,8.1 R53.1 16.43,8.1 14.9,6.24 14.9,3.28 15.16,3.02 C19.2
N$110  (via drill 0.51)
  Top 0.152: v25.64,6.83 25.64,5.56 25.48,5.4 MICRO-USB.D+
  Bottom 0.152: v25.64,6.83 25.64,4.13 24.03,2.55 24.02,2.54 20.42,2.54 19.69,1.8 15.01,1.8 15.01,1.81 14.5,2.65 14.52,6.41 14.84,6.98 14.84,8.1 R53.2
NOP  (via drill 0.51)
  Top 0.152: IC1.8 26.59,9.05 27.22,9.68 IC1.9 27.38,9.68 v28.33,9.68 | 22.62,11.59 22.33,11.69 21.22,10.58 21.35,8.41 C18.2 | 22.62,11.59 23.73,11.59 IC1.1 | 22.62,11.59 v22.62,12.7
  Route2 0.152: v28.33,9.68 25.64,9.68 v22.62,12.7
PCINT5  (via drill 0.51)
  Top 0.152: v40.24,7.14 40.88,7.78 43.89,7.78 U1.41
  Bottom 0.127: 40.22,6.84 39.38,6.66 38.89,6.55 38.25,6.32
  Bottom 0.152: 40.22,6.84 v40.24,7.14 | 38.25,6.32 38.18,5.71 U$1.12
PD2/INT2/RXD1  (via drill 0.51)
  Top 0.152: v38.65,7.3 39.61,6.35 40.72,6.35 40.72,3.17 U1.27 | v28.33,12.7 27.86,13.18 25.64,13.18 25.32,12.86 25.32,12.54 IC1.15
  Route2 0.152: v38.65,7.3 37.54,7.3 35.95,8.89 32.14,8.89 v28.33,12.7
PD3/INT3/TXD1  (via drill 0.6)
  Top 0.127: IC1.2 22.91,11.04 v22.55,10.69 | v31.37,1.17 31.8,0.41 41.53,0.43 41.78,0.69 41.78,1.88 41.27,2.39 41.27,3.02 U1.28
  Route2 0.127: v13.13,4.7 13.05,1.5 13.67,0.89 29.79,0.89 v31.37,1.17
  Route3 0.127: v22.55,10.69 13.84,10.69 13.28,10.13 13.28,8.05 12.65,7.42 12.65,5.31 v13.13,4.7
PDI
  Top 0.152: U1.38 44.05,6.35 45.32,6.35 46.27,7.3 53.26,7.3 53.42,7.46 55.32,7.46 56.43,6.35 SPI.4
PDO  (via drill 0.51)
  Top 0.152: v51.67,8.1 46.59,8.1 45.48,6.98 44.08,6.88 U1.39
  Bottom 0.152: v51.67,8.1 53.1,8.1 53.42,7.78 57.86,7.78 58.97,8.89 SPI.1
RESET  (via drill 0.51)
  Top 0.152: v33.89,5.87 34.84,5.87 U1.12 | R1.1 52.3,11.75 52.3,10.48 53.89,8.89 SPI.5
  Route3 0.152: v33.89,5.87 34.36,5.87 35.31,6.83 36.43,6.83 37.86,8.25 37.68,8.76 38.32,9.39 45.03,9.39 45.51,9.87 47.38,9.84 51.99,5.24 54.37,5.24 55,5.87 55,7.94 54.05,8.89 SPI.5
SCK  (via drill 0.51)
  Top 0.152: v45.8,5.71 45.64,5.87 44.05,5.87 U1.37
  Route2 0.152: v45.8,5.71 49.45,5.71 51.04,7.3 53.42,7.3 53.89,7.78 55.32,7.78 56.43,8.89 SPI.3
SCL  (via drill 0.51)
  Top 0.152: U1.25 39.61,3.02 39.61,2.7 38.49,1.59 38.02,1.59 SCL.1 | v45.95,8.57 51.04,8.57 v51.99,9.52
  Route3 0.152: v45.95,8.57 45.95,7.14 42.3,3.49 40.88,3.49 38.97,1.59 38.02,1.59 SCL.1
  Bottom 0.152: v45.95,8.57 43.1,11.43 41.51,11.43 40.24,10.16 40.24,9.68 U$1.23 | v51.99,9.52 52.94,9.52 55.16,11.75 55.96,11.75 R4.2
SDA
  Top 0.152: U1.26 40.24,3.02 40.24,1.75 40.4,1.59 SDA.1
  Bottom 0.152: 49.13,7.94 52.15,10.95 52.15,11.75 R2.2 | 49.13,7.94 48.97,7.78 45.64,7.78 42.46,10.95 41.83,10.95 41.35,10.48 41.35,10.32 40.72,9.68 U$1.24 | 49.13,7.94 51.99,5.08 51.99,3.33 50.72,2.06 45.64,2.06 45.32,2.38 42.15,2.38 41.35,1.59 40.56,1.59 SDA.1
VBAT  (via drill 0.51)
  Top 0.152: B.4 B.5 67.7,8.57 63.89,8.57 60.08,4.76 58.97,4.76 57.38,3.17 57.38,2.7 C5.2 57.23,2.54 56.43,1.75 51.99,1.75 50.4,3.33 v45.95,3.33
  Bottom 0.152: A.5 11.51,7.07 14.1,5.04 14.1,1.74 14.12,1.7 14.66,1.17 20.29,1.17 21.2,2.07 35.22,2.07 37.24,3.33 v45.95,3.33
VBUS  (via drill 0.51)
  Top 0.152: v28.33,10.95 27.86,10.48 27.38,10.48 IC1.10 | A.1 11.67,12.86 15.16,12.86 C16.2 | v18.49,7.3 18.81,6.98 23.09,6.98 24.05,6.03 24.05,5.4 MICRO-USB.VBUS | B.1 69.61,2.54 71.04,3.97 71.67,3.97 72.31,4.6 72.31,13.18 71.04,14.45 35.95,14.45 v35.64,14.13
  Route2 0.152: v28.33,10.95 25.48,10.95 22.94,13.49 12.3,13.49 A.1
  Route3 0.152: v35.64,14.13 34.68,14.13 31.51,10.95 v28.33,10.95
  Bottom 0.152: v18.49,7.3 18.49,7.78 13.57,12.7 A.1
VBUTTON  (via drill 0.51)
  Top 0.152: U1.40 44.05,7.46 44.37,7.46 45.16,8.25 45.16,8.89 46.11,9.84 47.38,9.84 C17.2 47.54,10 v47.54,11.27 | A.6 9.92,7.62 11.35,9.05 17.38,9.05 22.46,14.13 29.76,14.13 30.71,13.18 32.62,13.18 v32.94,13.49
  Route2 0.152: v32.94,13.49 35.16,13.49 36.27,12.38 46.43,12.38 v47.54,11.27
  Route3 0.152: v47.54,11.27 49.13,11.27 49.77,11.91 65.32,11.91 68.5,8.73 70.08,8.73 B.6
  Bottom 0.152: v47.54,11.27 47.54,10 R50.1
VIN  (via drill 0.51)
  Top 0.152: B.3 67.86,5.08 63.89,1.11 v44.05,1.11
  Route2 0.152: v44.05,1.11 42.46,2.7 35.64,2.7 35.19,2.3 17.86,2.22 v13.41,6.67
  Bottom 0.152: U$7.1 20.08,10.8 20.08,11.11 19.6,11.59 18.81,11.59 18.33,11.11 18.33,10.8 U$7.3 18.17,10.8 15.95,10.8 12.94,13.81 11.03,13.81 10.4,13.18 10.4,11.27 A.3 13.41,8.25 v13.41,6.67

### Text on the board
tPlace: I2C